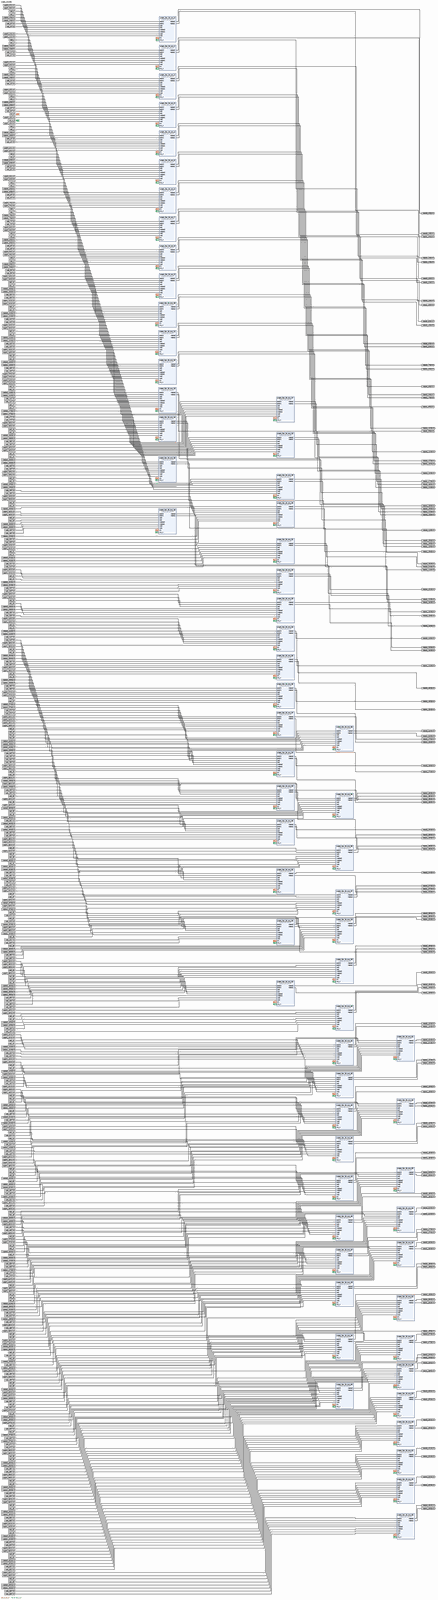
[diagram p0: block diagram of the top level, whole]
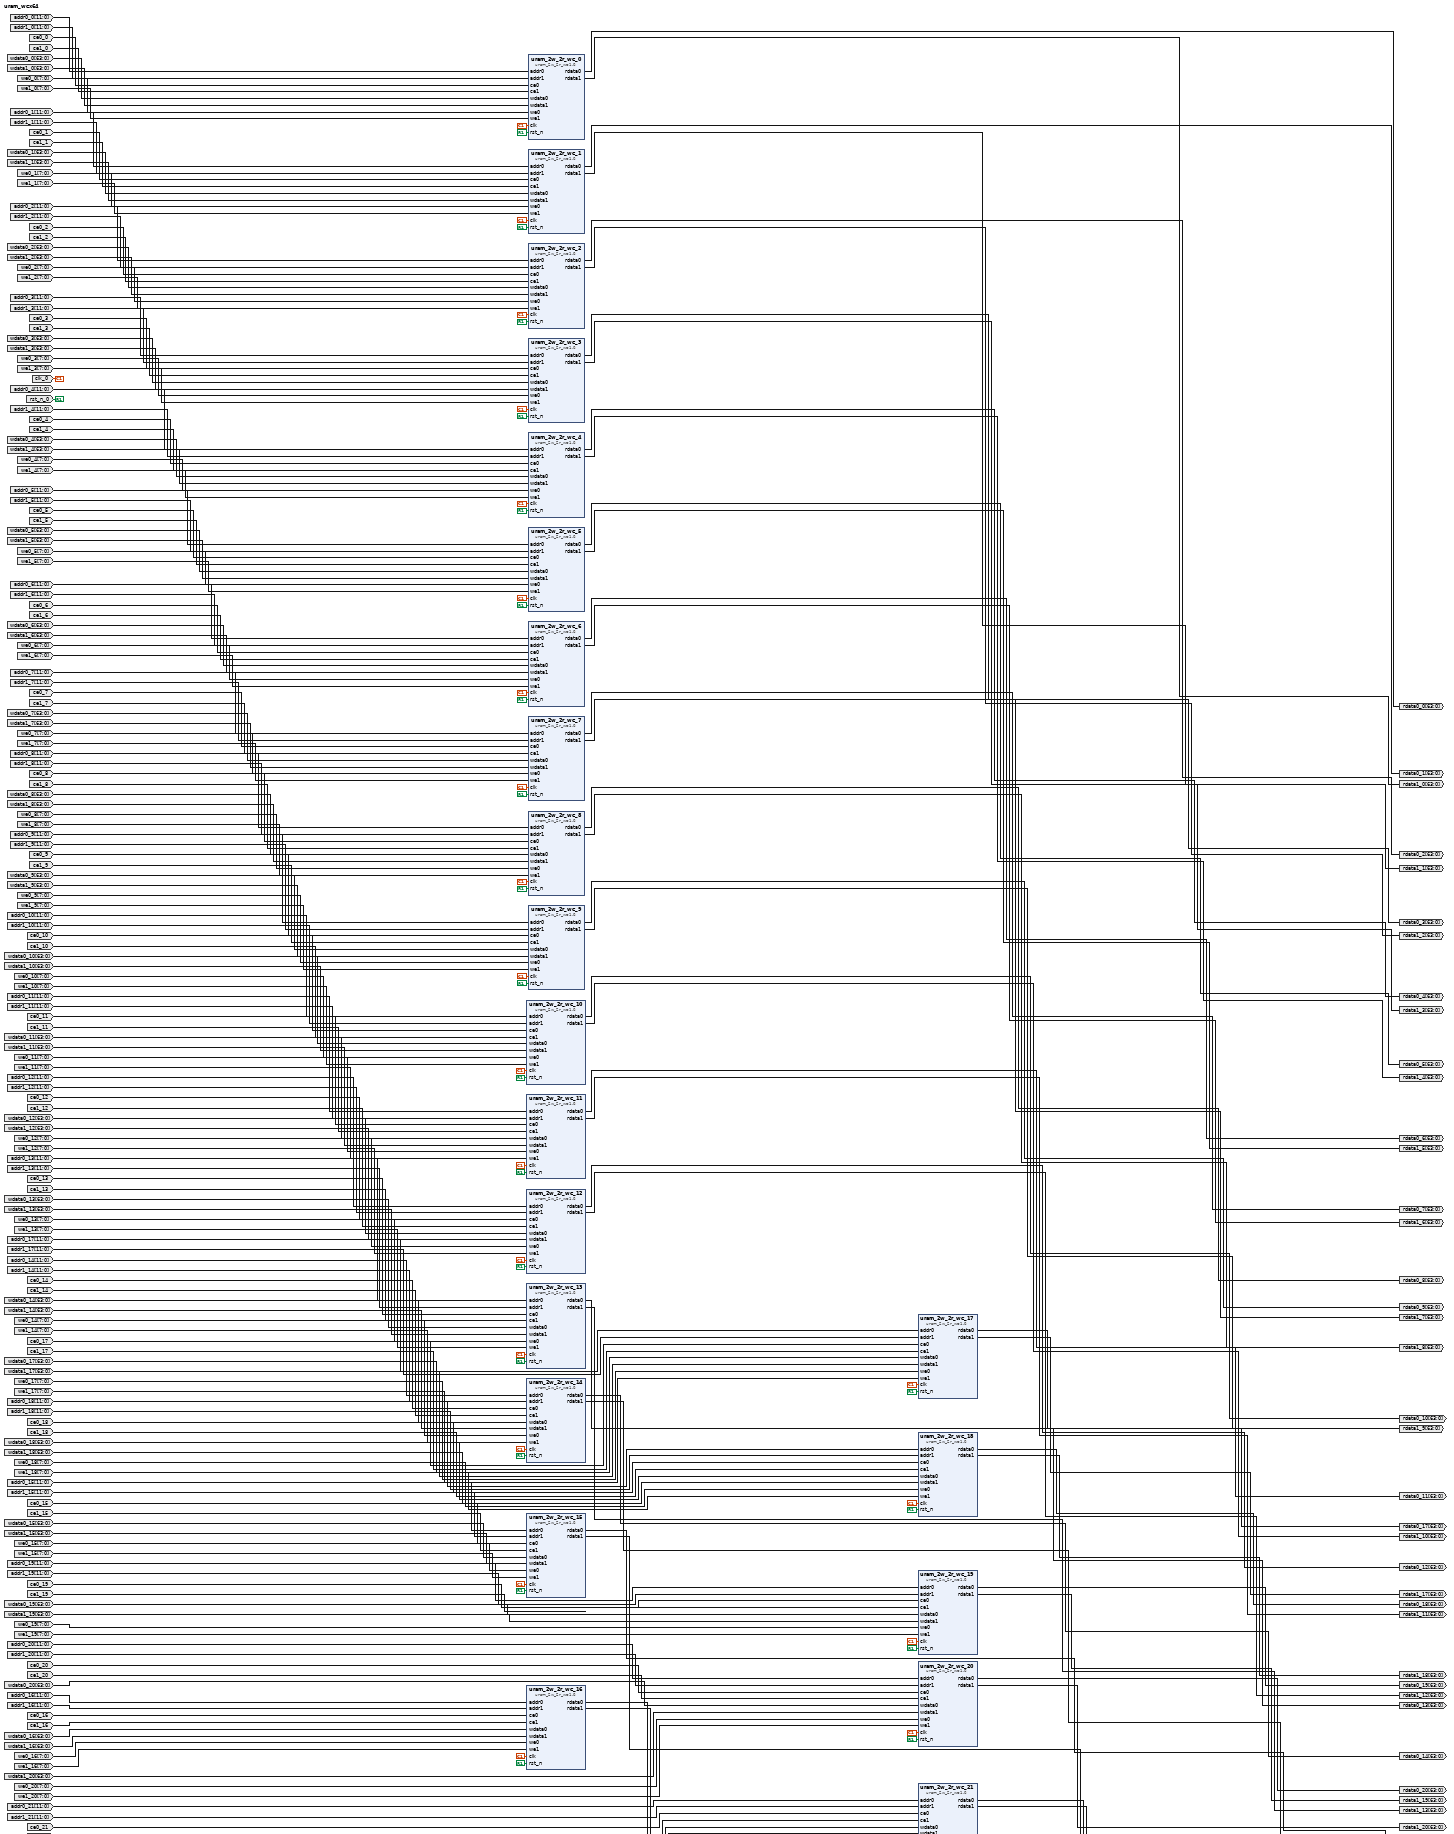
[diagram p1: block diagram of the top level, upper part]
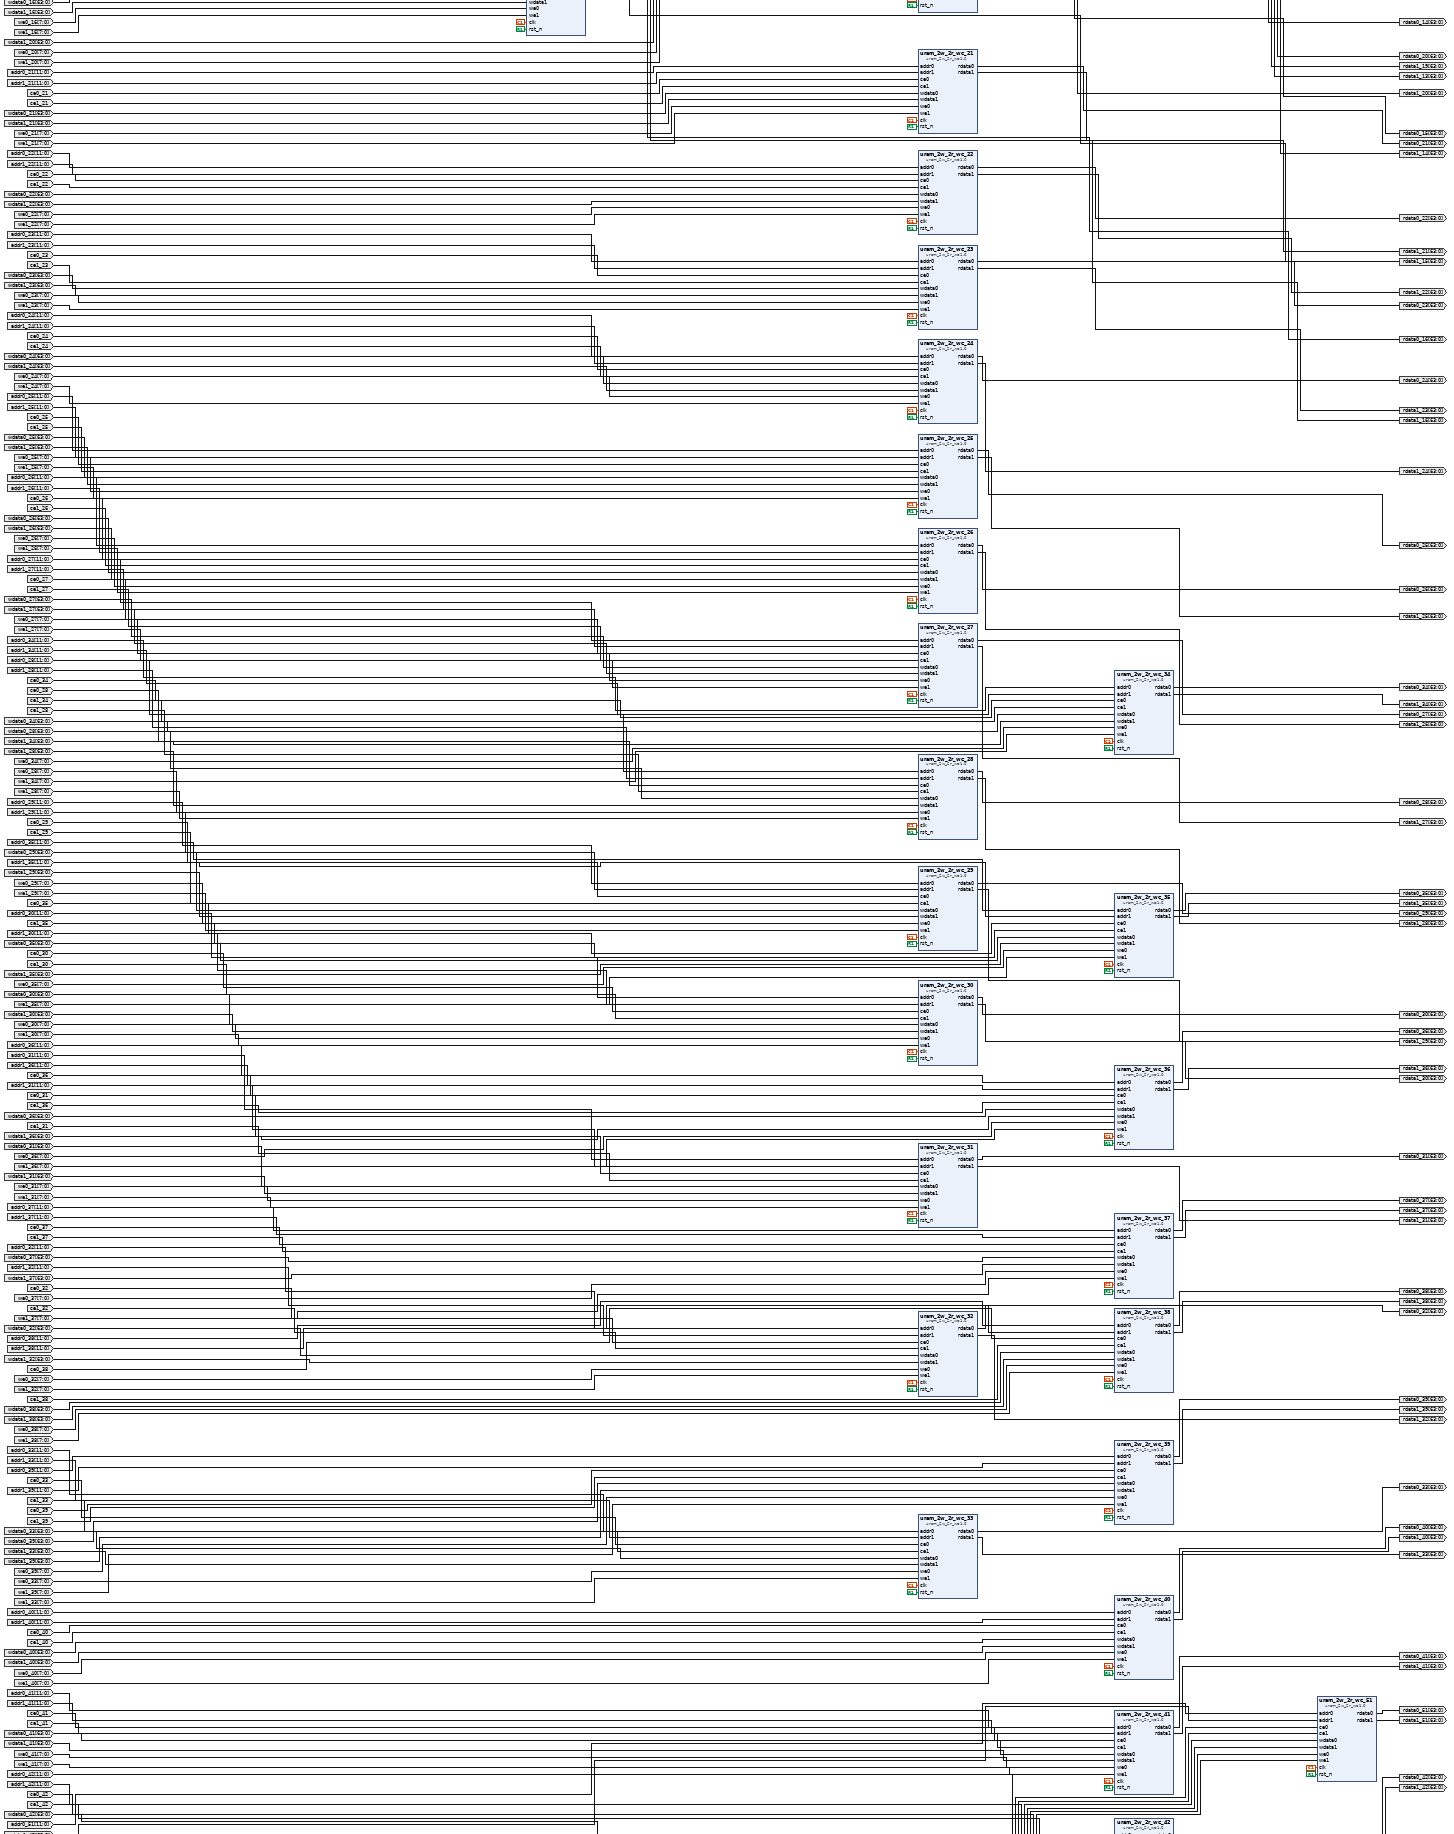
[diagram p2: block diagram of the top level, middle part]
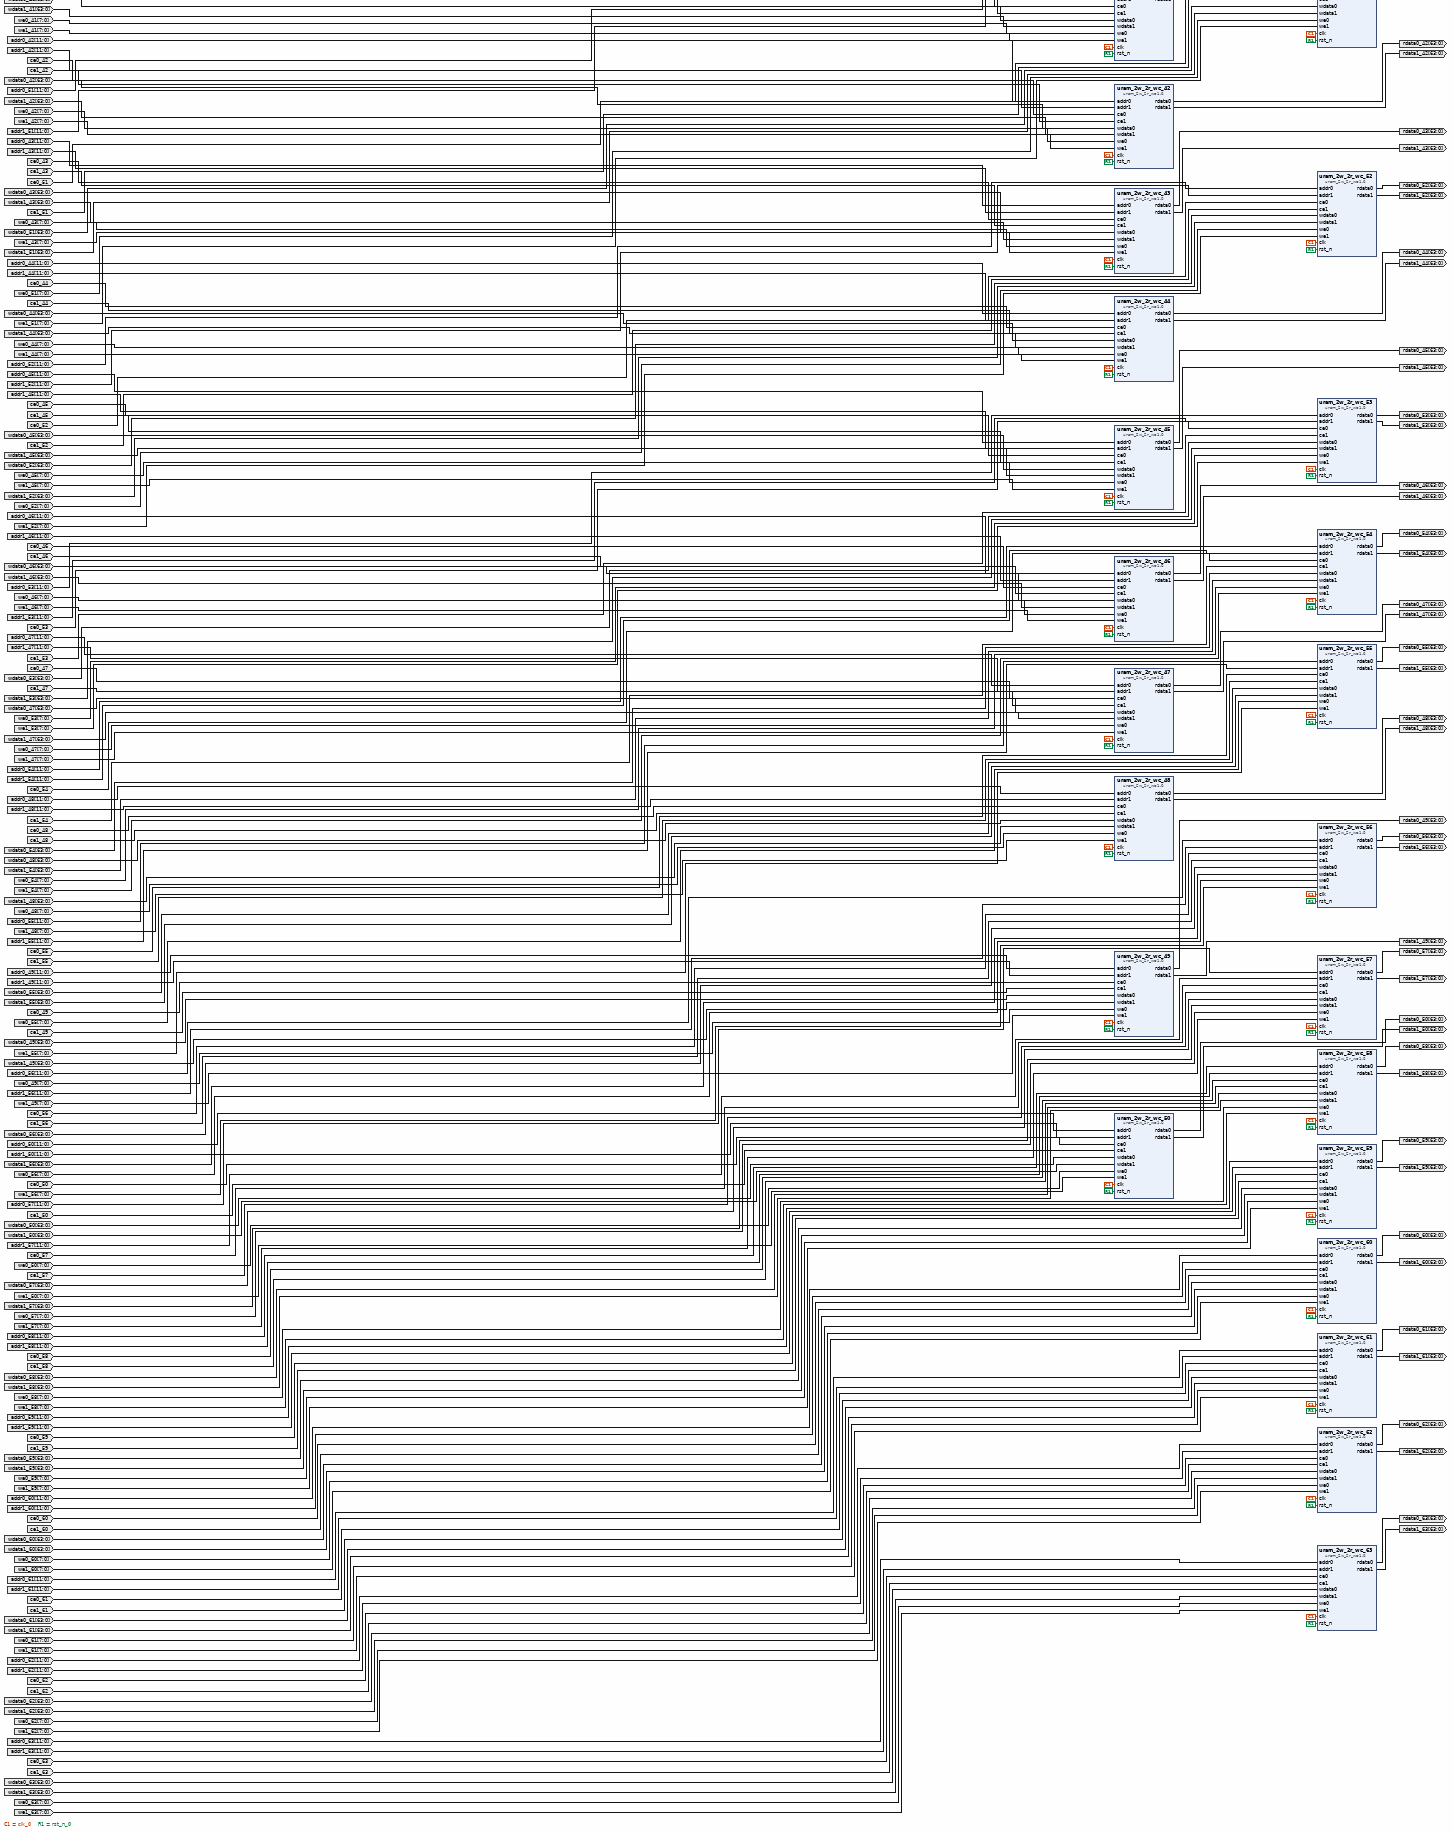
[diagram p3: block diagram of the top level, lower part]
# Vivado block design uram_wex64, xcu280-fsvh2892-2L-e, Vivado 2020.2
create_bd_design uram_wex64

create_bd_port -dir I -type clk clk_0
create_bd_port -dir I -type rst rst_n_0
create_bd_port -dir I -from 11 -to 0 addr0_0
create_bd_port -dir I -from 11 -to 0 addr1_0
create_bd_port -dir I ce0_0
create_bd_port -dir I ce1_0
create_bd_port -dir O -from 63 -to 0 rdata0_0
create_bd_port -dir O -from 63 -to 0 rdata1_0
create_bd_port -dir I -from 63 -to 0 wdata0_0
create_bd_port -dir I -from 63 -to 0 wdata1_0
create_bd_port -dir I -from 7 -to 0 we0_0
create_bd_port -dir I -from 7 -to 0 we1_0
create_bd_port -dir I -from 11 -to 0 addr0_1
create_bd_port -dir I -from 11 -to 0 addr1_1
create_bd_port -dir I ce0_1
create_bd_port -dir I ce1_1
create_bd_port -dir O -from 63 -to 0 rdata0_1
create_bd_port -dir O -from 63 -to 0 rdata1_1
create_bd_port -dir I -from 63 -to 0 wdata0_1
create_bd_port -dir I -from 63 -to 0 wdata1_1
create_bd_port -dir I -from 7 -to 0 we0_1
create_bd_port -dir I -from 7 -to 0 we1_1
create_bd_port -dir I -from 11 -to 0 addr0_2
create_bd_port -dir I -from 11 -to 0 addr1_2
create_bd_port -dir I ce0_2
create_bd_port -dir I ce1_2
create_bd_port -dir O -from 63 -to 0 rdata0_2
create_bd_port -dir O -from 63 -to 0 rdata1_2
create_bd_port -dir I -from 63 -to 0 wdata0_2
create_bd_port -dir I -from 63 -to 0 wdata1_2
create_bd_port -dir I -from 7 -to 0 we0_2
create_bd_port -dir I -from 7 -to 0 we1_2
create_bd_port -dir I -from 11 -to 0 addr0_3
create_bd_port -dir I -from 11 -to 0 addr1_3
create_bd_port -dir I ce0_3
create_bd_port -dir I ce1_3
create_bd_port -dir O -from 63 -to 0 rdata0_3
create_bd_port -dir O -from 63 -to 0 rdata1_3
create_bd_port -dir I -from 63 -to 0 wdata0_3
create_bd_port -dir I -from 63 -to 0 wdata1_3
create_bd_port -dir I -from 7 -to 0 we0_3
create_bd_port -dir I -from 7 -to 0 we1_3
create_bd_port -dir I -from 11 -to 0 addr0_4
create_bd_port -dir I -from 11 -to 0 addr1_4
create_bd_port -dir I ce0_4
create_bd_port -dir I ce1_4
create_bd_port -dir O -from 63 -to 0 rdata0_4
create_bd_port -dir O -from 63 -to 0 rdata1_4
create_bd_port -dir I -from 63 -to 0 wdata0_4
create_bd_port -dir I -from 63 -to 0 wdata1_4
create_bd_port -dir I -from 7 -to 0 we0_4
create_bd_port -dir I -from 7 -to 0 we1_4
create_bd_port -dir I -from 11 -to 0 addr0_5
create_bd_port -dir I -from 11 -to 0 addr1_5
create_bd_port -dir I ce0_5
create_bd_port -dir I ce1_5
create_bd_port -dir O -from 63 -to 0 rdata0_5
create_bd_port -dir O -from 63 -to 0 rdata1_5
create_bd_port -dir I -from 63 -to 0 wdata0_5
create_bd_port -dir I -from 63 -to 0 wdata1_5
create_bd_port -dir I -from 7 -to 0 we0_5
create_bd_port -dir I -from 7 -to 0 we1_5
create_bd_port -dir I -from 11 -to 0 addr0_6
create_bd_port -dir I -from 11 -to 0 addr1_6
create_bd_port -dir I ce0_6
create_bd_port -dir I ce1_6
create_bd_port -dir O -from 63 -to 0 rdata0_6
create_bd_port -dir O -from 63 -to 0 rdata1_6
create_bd_port -dir I -from 63 -to 0 wdata0_6
create_bd_port -dir I -from 63 -to 0 wdata1_6
create_bd_port -dir I -from 7 -to 0 we0_6
create_bd_port -dir I -from 7 -to 0 we1_6
create_bd_port -dir I -from 11 -to 0 addr0_7
create_bd_port -dir I -from 11 -to 0 addr1_7
create_bd_port -dir I ce0_7
create_bd_port -dir I ce1_7
create_bd_port -dir O -from 63 -to 0 rdata0_7
create_bd_port -dir O -from 63 -to 0 rdata1_7
create_bd_port -dir I -from 63 -to 0 wdata0_7
create_bd_port -dir I -from 63 -to 0 wdata1_7
create_bd_port -dir I -from 7 -to 0 we0_7
create_bd_port -dir I -from 7 -to 0 we1_7
create_bd_port -dir I -from 11 -to 0 addr0_8
create_bd_port -dir I -from 11 -to 0 addr1_8
create_bd_port -dir I ce0_8
create_bd_port -dir I ce1_8
create_bd_port -dir O -from 63 -to 0 rdata0_8
create_bd_port -dir O -from 63 -to 0 rdata1_8
create_bd_port -dir I -from 63 -to 0 wdata0_8
create_bd_port -dir I -from 63 -to 0 wdata1_8
create_bd_port -dir I -from 7 -to 0 we0_8
create_bd_port -dir I -from 7 -to 0 we1_8
create_bd_port -dir I -from 11 -to 0 addr0_9
create_bd_port -dir I -from 11 -to 0 addr1_9
create_bd_port -dir I ce0_9
create_bd_port -dir I ce1_9
create_bd_port -dir O -from 63 -to 0 rdata0_9
create_bd_port -dir O -from 63 -to 0 rdata1_9
create_bd_port -dir I -from 63 -to 0 wdata0_9
create_bd_port -dir I -from 63 -to 0 wdata1_9
create_bd_port -dir I -from 7 -to 0 we0_9
create_bd_port -dir I -from 7 -to 0 we1_9
create_bd_port -dir I -from 11 -to 0 addr0_10
create_bd_port -dir I -from 11 -to 0 addr1_10
create_bd_port -dir I ce0_10
create_bd_port -dir I ce1_10
create_bd_port -dir O -from 63 -to 0 rdata0_10
create_bd_port -dir O -from 63 -to 0 rdata1_10
create_bd_port -dir I -from 63 -to 0 wdata0_10
create_bd_port -dir I -from 63 -to 0 wdata1_10
create_bd_port -dir I -from 7 -to 0 we0_10
create_bd_port -dir I -from 7 -to 0 we1_10
create_bd_port -dir I -from 11 -to 0 addr0_11
create_bd_port -dir I -from 11 -to 0 addr1_11
create_bd_port -dir I ce0_11
create_bd_port -dir I ce1_11
create_bd_port -dir O -from 63 -to 0 rdata0_11
create_bd_port -dir O -from 63 -to 0 rdata1_11
create_bd_port -dir I -from 63 -to 0 wdata0_11
create_bd_port -dir I -from 63 -to 0 wdata1_11
create_bd_port -dir I -from 7 -to 0 we0_11
create_bd_port -dir I -from 7 -to 0 we1_11
create_bd_port -dir I -from 11 -to 0 addr0_12
create_bd_port -dir I -from 11 -to 0 addr1_12
create_bd_port -dir I ce0_12
create_bd_port -dir I ce1_12
create_bd_port -dir O -from 63 -to 0 rdata0_12
create_bd_port -dir O -from 63 -to 0 rdata1_12
create_bd_port -dir I -from 63 -to 0 wdata0_12
create_bd_port -dir I -from 63 -to 0 wdata1_12
create_bd_port -dir I -from 7 -to 0 we0_12
create_bd_port -dir I -from 7 -to 0 we1_12
create_bd_port -dir I -from 11 -to 0 addr0_13
create_bd_port -dir I -from 11 -to 0 addr1_13
create_bd_port -dir I ce0_13
create_bd_port -dir I ce1_13
create_bd_port -dir O -from 63 -to 0 rdata0_13
create_bd_port -dir O -from 63 -to 0 rdata1_13
create_bd_port -dir I -from 63 -to 0 wdata0_13
create_bd_port -dir I -from 63 -to 0 wdata1_13
create_bd_port -dir I -from 7 -to 0 we0_13
create_bd_port -dir I -from 7 -to 0 we1_13
create_bd_port -dir I -from 11 -to 0 addr0_14
create_bd_port -dir I -from 11 -to 0 addr1_14
create_bd_port -dir I ce0_14
create_bd_port -dir I ce1_14
create_bd_port -dir O -from 63 -to 0 rdata0_14
create_bd_port -dir O -from 63 -to 0 rdata1_14
create_bd_port -dir I -from 63 -to 0 wdata0_14
create_bd_port -dir I -from 63 -to 0 wdata1_14
create_bd_port -dir I -from 7 -to 0 we0_14
create_bd_port -dir I -from 7 -to 0 we1_14
create_bd_port -dir I -from 11 -to 0 addr0_15
create_bd_port -dir I -from 11 -to 0 addr1_15
create_bd_port -dir I ce0_15
create_bd_port -dir I ce1_15
create_bd_port -dir O -from 63 -to 0 rdata0_15
create_bd_port -dir O -from 63 -to 0 rdata1_15
create_bd_port -dir I -from 63 -to 0 wdata0_15
create_bd_port -dir I -from 63 -to 0 wdata1_15
create_bd_port -dir I -from 7 -to 0 we0_15
create_bd_port -dir I -from 7 -to 0 we1_15
create_bd_port -dir I -from 11 -to 0 addr0_16
create_bd_port -dir I -from 11 -to 0 addr1_16
create_bd_port -dir I ce0_16
create_bd_port -dir I ce1_16
create_bd_port -dir O -from 63 -to 0 rdata0_16
create_bd_port -dir O -from 63 -to 0 rdata1_16
create_bd_port -dir I -from 63 -to 0 wdata0_16
create_bd_port -dir I -from 63 -to 0 wdata1_16
create_bd_port -dir I -from 7 -to 0 we0_16
create_bd_port -dir I -from 7 -to 0 we1_16
create_bd_port -dir I -from 11 -to 0 addr0_17
create_bd_port -dir I -from 11 -to 0 addr1_17
create_bd_port -dir I ce0_17
create_bd_port -dir I ce1_17
create_bd_port -dir O -from 63 -to 0 rdata0_17
create_bd_port -dir O -from 63 -to 0 rdata1_17
create_bd_port -dir I -from 63 -to 0 wdata0_17
create_bd_port -dir I -from 63 -to 0 wdata1_17
create_bd_port -dir I -from 7 -to 0 we0_17
create_bd_port -dir I -from 7 -to 0 we1_17
create_bd_port -dir I -from 11 -to 0 addr0_18
create_bd_port -dir I -from 11 -to 0 addr1_18
create_bd_port -dir I ce0_18
create_bd_port -dir I ce1_18
create_bd_port -dir O -from 63 -to 0 rdata0_18
create_bd_port -dir O -from 63 -to 0 rdata1_18
create_bd_port -dir I -from 63 -to 0 wdata0_18
create_bd_port -dir I -from 63 -to 0 wdata1_18
create_bd_port -dir I -from 7 -to 0 we0_18
create_bd_port -dir I -from 7 -to 0 we1_18
create_bd_port -dir I -from 11 -to 0 addr0_19
create_bd_port -dir I -from 11 -to 0 addr1_19
create_bd_port -dir I ce0_19
create_bd_port -dir I ce1_19
create_bd_port -dir O -from 63 -to 0 rdata0_19
create_bd_port -dir O -from 63 -to 0 rdata1_19
create_bd_port -dir I -from 63 -to 0 wdata0_19
create_bd_port -dir I -from 63 -to 0 wdata1_19
create_bd_port -dir I -from 7 -to 0 we0_19
create_bd_port -dir I -from 7 -to 0 we1_19
create_bd_port -dir I -from 11 -to 0 addr0_20
create_bd_port -dir I -from 11 -to 0 addr1_20
create_bd_port -dir I ce0_20
create_bd_port -dir I ce1_20
create_bd_port -dir O -from 63 -to 0 rdata0_20
create_bd_port -dir O -from 63 -to 0 rdata1_20
create_bd_port -dir I -from 63 -to 0 wdata0_20
create_bd_port -dir I -from 63 -to 0 wdata1_20
create_bd_port -dir I -from 7 -to 0 we0_20
create_bd_port -dir I -from 7 -to 0 we1_20
create_bd_port -dir I -from 11 -to 0 addr0_21
create_bd_port -dir I -from 11 -to 0 addr1_21
create_bd_port -dir I ce0_21
create_bd_port -dir I ce1_21
create_bd_port -dir O -from 63 -to 0 rdata0_21
create_bd_port -dir O -from 63 -to 0 rdata1_21
create_bd_port -dir I -from 63 -to 0 wdata0_21
create_bd_port -dir I -from 63 -to 0 wdata1_21
create_bd_port -dir I -from 7 -to 0 we0_21
create_bd_port -dir I -from 7 -to 0 we1_21
create_bd_port -dir I -from 11 -to 0 addr0_22
create_bd_port -dir I -from 11 -to 0 addr1_22
create_bd_port -dir I ce0_22
create_bd_port -dir I ce1_22
create_bd_port -dir O -from 63 -to 0 rdata0_22
create_bd_port -dir O -from 63 -to 0 rdata1_22
create_bd_port -dir I -from 63 -to 0 wdata0_22
create_bd_port -dir I -from 63 -to 0 wdata1_22
create_bd_port -dir I -from 7 -to 0 we0_22
create_bd_port -dir I -from 7 -to 0 we1_22
create_bd_port -dir I -from 11 -to 0 addr0_23
create_bd_port -dir I -from 11 -to 0 addr1_23
create_bd_port -dir I ce0_23
create_bd_port -dir I ce1_23
create_bd_port -dir O -from 63 -to 0 rdata0_23
create_bd_port -dir O -from 63 -to 0 rdata1_23
create_bd_port -dir I -from 63 -to 0 wdata0_23
create_bd_port -dir I -from 63 -to 0 wdata1_23
create_bd_port -dir I -from 7 -to 0 we0_23
create_bd_port -dir I -from 7 -to 0 we1_23
create_bd_port -dir I -from 11 -to 0 addr0_24
create_bd_port -dir I -from 11 -to 0 addr1_24
create_bd_port -dir I ce0_24
create_bd_port -dir I ce1_24
create_bd_port -dir O -from 63 -to 0 rdata0_24
create_bd_port -dir O -from 63 -to 0 rdata1_24
create_bd_port -dir I -from 63 -to 0 wdata0_24
create_bd_port -dir I -from 63 -to 0 wdata1_24
create_bd_port -dir I -from 7 -to 0 we0_24
create_bd_port -dir I -from 7 -to 0 we1_24
create_bd_port -dir I -from 11 -to 0 addr0_25
create_bd_port -dir I -from 11 -to 0 addr1_25
create_bd_port -dir I ce0_25
create_bd_port -dir I ce1_25
create_bd_port -dir O -from 63 -to 0 rdata0_25
create_bd_port -dir O -from 63 -to 0 rdata1_25
create_bd_port -dir I -from 63 -to 0 wdata0_25
create_bd_port -dir I -from 63 -to 0 wdata1_25
create_bd_port -dir I -from 7 -to 0 we0_25
create_bd_port -dir I -from 7 -to 0 we1_25
create_bd_port -dir I -from 11 -to 0 addr0_26
create_bd_port -dir I -from 11 -to 0 addr1_26
create_bd_port -dir I ce0_26
create_bd_port -dir I ce1_26
create_bd_port -dir O -from 63 -to 0 rdata0_26
create_bd_port -dir O -from 63 -to 0 rdata1_26
create_bd_port -dir I -from 63 -to 0 wdata0_26
create_bd_port -dir I -from 63 -to 0 wdata1_26
create_bd_port -dir I -from 7 -to 0 we0_26
create_bd_port -dir I -from 7 -to 0 we1_26
create_bd_port -dir I -from 11 -to 0 addr0_27
create_bd_port -dir I -from 11 -to 0 addr1_27
create_bd_port -dir I ce0_27
create_bd_port -dir I ce1_27
create_bd_port -dir O -from 63 -to 0 rdata0_27
create_bd_port -dir O -from 63 -to 0 rdata1_27
create_bd_port -dir I -from 63 -to 0 wdata0_27
create_bd_port -dir I -from 63 -to 0 wdata1_27
create_bd_port -dir I -from 7 -to 0 we0_27
create_bd_port -dir I -from 7 -to 0 we1_27
create_bd_port -dir I -from 11 -to 0 addr0_28
create_bd_port -dir I -from 11 -to 0 addr1_28
create_bd_port -dir I ce0_28
create_bd_port -dir I ce1_28
create_bd_port -dir O -from 63 -to 0 rdata0_28
create_bd_port -dir O -from 63 -to 0 rdata1_28
create_bd_port -dir I -from 63 -to 0 wdata0_28
create_bd_port -dir I -from 63 -to 0 wdata1_28
create_bd_port -dir I -from 7 -to 0 we0_28
create_bd_port -dir I -from 7 -to 0 we1_28
create_bd_port -dir I -from 11 -to 0 addr0_29
create_bd_port -dir I -from 11 -to 0 addr1_29
create_bd_port -dir I ce0_29
create_bd_port -dir I ce1_29
create_bd_port -dir O -from 63 -to 0 rdata0_29
create_bd_port -dir O -from 63 -to 0 rdata1_29
create_bd_port -dir I -from 63 -to 0 wdata0_29
create_bd_port -dir I -from 63 -to 0 wdata1_29
create_bd_port -dir I -from 7 -to 0 we0_29
create_bd_port -dir I -from 7 -to 0 we1_29
create_bd_port -dir I -from 11 -to 0 addr0_30
create_bd_port -dir I -from 11 -to 0 addr1_30
create_bd_port -dir I ce0_30
create_bd_port -dir I ce1_30
create_bd_port -dir O -from 63 -to 0 rdata0_30
create_bd_port -dir O -from 63 -to 0 rdata1_30
create_bd_port -dir I -from 63 -to 0 wdata0_30
create_bd_port -dir I -from 63 -to 0 wdata1_30
create_bd_port -dir I -from 7 -to 0 we0_30
create_bd_port -dir I -from 7 -to 0 we1_30
create_bd_port -dir I -from 11 -to 0 addr0_31
create_bd_port -dir I -from 11 -to 0 addr1_31
create_bd_port -dir I ce0_31
create_bd_port -dir I ce1_31
create_bd_port -dir O -from 63 -to 0 rdata0_31
create_bd_port -dir O -from 63 -to 0 rdata1_31
create_bd_port -dir I -from 63 -to 0 wdata0_31
create_bd_port -dir I -from 63 -to 0 wdata1_31
create_bd_port -dir I -from 7 -to 0 we0_31
create_bd_port -dir I -from 7 -to 0 we1_31
create_bd_port -dir I -from 11 -to 0 addr0_32
create_bd_port -dir I -from 11 -to 0 addr1_32
create_bd_port -dir I ce0_32
create_bd_port -dir I ce1_32
create_bd_port -dir O -from 63 -to 0 rdata0_32
create_bd_port -dir O -from 63 -to 0 rdata1_32
create_bd_port -dir I -from 63 -to 0 wdata0_32
create_bd_port -dir I -from 63 -to 0 wdata1_32
create_bd_port -dir I -from 7 -to 0 we0_32
create_bd_port -dir I -from 7 -to 0 we1_32
create_bd_port -dir I -from 11 -to 0 addr0_33
create_bd_port -dir I -from 11 -to 0 addr1_33
create_bd_port -dir I ce0_33
create_bd_port -dir I ce1_33
create_bd_port -dir O -from 63 -to 0 rdata0_33
create_bd_port -dir O -from 63 -to 0 rdata1_33
create_bd_port -dir I -from 63 -to 0 wdata0_33
create_bd_port -dir I -from 63 -to 0 wdata1_33
create_bd_port -dir I -from 7 -to 0 we0_33
create_bd_port -dir I -from 7 -to 0 we1_33
create_bd_port -dir I -from 11 -to 0 addr0_34
create_bd_port -dir I -from 11 -to 0 addr1_34
create_bd_port -dir I ce0_34
create_bd_port -dir I ce1_34
create_bd_port -dir O -from 63 -to 0 rdata0_34
create_bd_port -dir O -from 63 -to 0 rdata1_34
create_bd_port -dir I -from 63 -to 0 wdata0_34
create_bd_port -dir I -from 63 -to 0 wdata1_34
create_bd_port -dir I -from 7 -to 0 we0_34
create_bd_port -dir I -from 7 -to 0 we1_34
create_bd_port -dir I -from 11 -to 0 addr0_35
create_bd_port -dir I -from 11 -to 0 addr1_35
create_bd_port -dir I ce0_35
create_bd_port -dir I ce1_35
create_bd_port -dir O -from 63 -to 0 rdata0_35
create_bd_port -dir O -from 63 -to 0 rdata1_35
create_bd_port -dir I -from 63 -to 0 wdata0_35
create_bd_port -dir I -from 63 -to 0 wdata1_35
create_bd_port -dir I -from 7 -to 0 we0_35
create_bd_port -dir I -from 7 -to 0 we1_35
create_bd_port -dir I -from 11 -to 0 addr0_36
create_bd_port -dir I -from 11 -to 0 addr1_36
create_bd_port -dir I ce0_36
create_bd_port -dir I ce1_36
create_bd_port -dir O -from 63 -to 0 rdata0_36
create_bd_port -dir O -from 63 -to 0 rdata1_36
create_bd_port -dir I -from 63 -to 0 wdata0_36
create_bd_port -dir I -from 63 -to 0 wdata1_36
create_bd_port -dir I -from 7 -to 0 we0_36
create_bd_port -dir I -from 7 -to 0 we1_36
create_bd_port -dir I -from 11 -to 0 addr0_37
create_bd_port -dir I -from 11 -to 0 addr1_37
create_bd_port -dir I ce0_37
create_bd_port -dir I ce1_37
create_bd_port -dir O -from 63 -to 0 rdata0_37
create_bd_port -dir O -from 63 -to 0 rdata1_37
create_bd_port -dir I -from 63 -to 0 wdata0_37
create_bd_port -dir I -from 63 -to 0 wdata1_37
create_bd_port -dir I -from 7 -to 0 we0_37
create_bd_port -dir I -from 7 -to 0 we1_37
create_bd_port -dir I -from 11 -to 0 addr0_38
create_bd_port -dir I -from 11 -to 0 addr1_38
create_bd_port -dir I ce0_38
create_bd_port -dir I ce1_38
create_bd_port -dir O -from 63 -to 0 rdata0_38
create_bd_port -dir O -from 63 -to 0 rdata1_38
create_bd_port -dir I -from 63 -to 0 wdata0_38
create_bd_port -dir I -from 63 -to 0 wdata1_38
create_bd_port -dir I -from 7 -to 0 we0_38
create_bd_port -dir I -from 7 -to 0 we1_38
create_bd_port -dir I -from 11 -to 0 addr0_39
create_bd_port -dir I -from 11 -to 0 addr1_39
create_bd_port -dir I ce0_39
create_bd_port -dir I ce1_39
create_bd_port -dir O -from 63 -to 0 rdata0_39
create_bd_port -dir O -from 63 -to 0 rdata1_39
create_bd_port -dir I -from 63 -to 0 wdata0_39
create_bd_port -dir I -from 63 -to 0 wdata1_39
create_bd_port -dir I -from 7 -to 0 we0_39
create_bd_port -dir I -from 7 -to 0 we1_39
create_bd_port -dir I -from 11 -to 0 addr0_40
create_bd_port -dir I -from 11 -to 0 addr1_40
create_bd_port -dir I ce0_40
create_bd_port -dir I ce1_40
create_bd_port -dir O -from 63 -to 0 rdata0_40
create_bd_port -dir O -from 63 -to 0 rdata1_40
create_bd_port -dir I -from 63 -to 0 wdata0_40
create_bd_port -dir I -from 63 -to 0 wdata1_40
create_bd_port -dir I -from 7 -to 0 we0_40
create_bd_port -dir I -from 7 -to 0 we1_40
create_bd_port -dir I -from 11 -to 0 addr0_41
create_bd_port -dir I -from 11 -to 0 addr1_41
create_bd_port -dir I ce0_41
create_bd_port -dir I ce1_41
create_bd_port -dir O -from 63 -to 0 rdata0_41
create_bd_port -dir O -from 63 -to 0 rdata1_41
create_bd_port -dir I -from 63 -to 0 wdata0_41
create_bd_port -dir I -from 63 -to 0 wdata1_41
create_bd_port -dir I -from 7 -to 0 we0_41
create_bd_port -dir I -from 7 -to 0 we1_41
create_bd_port -dir I -from 11 -to 0 addr0_42
create_bd_port -dir I -from 11 -to 0 addr1_42
create_bd_port -dir I ce0_42
create_bd_port -dir I ce1_42
create_bd_port -dir O -from 63 -to 0 rdata0_42
create_bd_port -dir O -from 63 -to 0 rdata1_42
create_bd_port -dir I -from 63 -to 0 wdata0_42
create_bd_port -dir I -from 63 -to 0 wdata1_42
create_bd_port -dir I -from 7 -to 0 we0_42
create_bd_port -dir I -from 7 -to 0 we1_42
create_bd_port -dir I -from 11 -to 0 addr0_43
create_bd_port -dir I -from 11 -to 0 addr1_43
create_bd_port -dir I ce0_43
create_bd_port -dir I ce1_43
create_bd_port -dir O -from 63 -to 0 rdata0_43
create_bd_port -dir O -from 63 -to 0 rdata1_43
create_bd_port -dir I -from 63 -to 0 wdata0_43
create_bd_port -dir I -from 63 -to 0 wdata1_43
create_bd_port -dir I -from 7 -to 0 we0_43
create_bd_port -dir I -from 7 -to 0 we1_43
create_bd_port -dir I -from 11 -to 0 addr0_44
create_bd_port -dir I -from 11 -to 0 addr1_44
create_bd_port -dir I ce0_44
create_bd_port -dir I ce1_44
create_bd_port -dir O -from 63 -to 0 rdata0_44
create_bd_port -dir O -from 63 -to 0 rdata1_44
create_bd_port -dir I -from 63 -to 0 wdata0_44
create_bd_port -dir I -from 63 -to 0 wdata1_44
create_bd_port -dir I -from 7 -to 0 we0_44
create_bd_port -dir I -from 7 -to 0 we1_44
create_bd_port -dir I -from 11 -to 0 addr0_45
create_bd_port -dir I -from 11 -to 0 addr1_45
create_bd_port -dir I ce0_45
create_bd_port -dir I ce1_45
create_bd_port -dir O -from 63 -to 0 rdata0_45
create_bd_port -dir O -from 63 -to 0 rdata1_45
create_bd_port -dir I -from 63 -to 0 wdata0_45
create_bd_port -dir I -from 63 -to 0 wdata1_45
create_bd_port -dir I -from 7 -to 0 we0_45
create_bd_port -dir I -from 7 -to 0 we1_45
create_bd_port -dir I -from 11 -to 0 addr0_46
create_bd_port -dir I -from 11 -to 0 addr1_46
create_bd_port -dir I ce0_46
create_bd_port -dir I ce1_46
create_bd_port -dir O -from 63 -to 0 rdata0_46
create_bd_port -dir O -from 63 -to 0 rdata1_46
create_bd_port -dir I -from 63 -to 0 wdata0_46
create_bd_port -dir I -from 63 -to 0 wdata1_46
create_bd_port -dir I -from 7 -to 0 we0_46
create_bd_port -dir I -from 7 -to 0 we1_46
create_bd_port -dir I -from 11 -to 0 addr0_47
create_bd_port -dir I -from 11 -to 0 addr1_47
create_bd_port -dir I ce0_47
create_bd_port -dir I ce1_47
create_bd_port -dir O -from 63 -to 0 rdata0_47
create_bd_port -dir O -from 63 -to 0 rdata1_47
create_bd_port -dir I -from 63 -to 0 wdata0_47
create_bd_port -dir I -from 63 -to 0 wdata1_47
create_bd_port -dir I -from 7 -to 0 we0_47
create_bd_port -dir I -from 7 -to 0 we1_47
create_bd_port -dir I -from 11 -to 0 addr0_48
create_bd_port -dir I -from 11 -to 0 addr1_48
create_bd_port -dir I ce0_48
create_bd_port -dir I ce1_48
create_bd_port -dir O -from 63 -to 0 rdata0_48
create_bd_port -dir O -from 63 -to 0 rdata1_48
create_bd_port -dir I -from 63 -to 0 wdata0_48
create_bd_port -dir I -from 63 -to 0 wdata1_48
create_bd_port -dir I -from 7 -to 0 we0_48
create_bd_port -dir I -from 7 -to 0 we1_48
create_bd_port -dir I -from 11 -to 0 addr0_49
create_bd_port -dir I -from 11 -to 0 addr1_49
create_bd_port -dir I ce0_49
create_bd_port -dir I ce1_49
create_bd_port -dir O -from 63 -to 0 rdata0_49
create_bd_port -dir O -from 63 -to 0 rdata1_49
create_bd_port -dir I -from 63 -to 0 wdata0_49
create_bd_port -dir I -from 63 -to 0 wdata1_49
create_bd_port -dir I -from 7 -to 0 we0_49
create_bd_port -dir I -from 7 -to 0 we1_49
create_bd_port -dir I -from 11 -to 0 addr0_50
create_bd_port -dir I -from 11 -to 0 addr1_50
create_bd_port -dir I ce0_50
create_bd_port -dir I ce1_50
create_bd_port -dir O -from 63 -to 0 rdata0_50
create_bd_port -dir O -from 63 -to 0 rdata1_50
create_bd_port -dir I -from 63 -to 0 wdata0_50
create_bd_port -dir I -from 63 -to 0 wdata1_50
create_bd_port -dir I -from 7 -to 0 we0_50
create_bd_port -dir I -from 7 -to 0 we1_50
create_bd_port -dir I -from 11 -to 0 addr0_51
create_bd_port -dir I -from 11 -to 0 addr1_51
create_bd_port -dir I ce0_51
create_bd_port -dir I ce1_51
create_bd_port -dir O -from 63 -to 0 rdata0_51
create_bd_port -dir O -from 63 -to 0 rdata1_51
create_bd_port -dir I -from 63 -to 0 wdata0_51
create_bd_port -dir I -from 63 -to 0 wdata1_51
create_bd_port -dir I -from 7 -to 0 we0_51
create_bd_port -dir I -from 7 -to 0 we1_51
create_bd_port -dir I -from 11 -to 0 addr0_52
create_bd_port -dir I -from 11 -to 0 addr1_52
create_bd_port -dir I ce0_52
create_bd_port -dir I ce1_52
create_bd_port -dir O -from 63 -to 0 rdata0_52
create_bd_port -dir O -from 63 -to 0 rdata1_52
create_bd_port -dir I -from 63 -to 0 wdata0_52
create_bd_port -dir I -from 63 -to 0 wdata1_52
create_bd_port -dir I -from 7 -to 0 we0_52
create_bd_port -dir I -from 7 -to 0 we1_52
create_bd_port -dir I -from 11 -to 0 addr0_53
create_bd_port -dir I -from 11 -to 0 addr1_53
create_bd_port -dir I ce0_53
create_bd_port -dir I ce1_53
create_bd_port -dir O -from 63 -to 0 rdata0_53
create_bd_port -dir O -from 63 -to 0 rdata1_53
create_bd_port -dir I -from 63 -to 0 wdata0_53
create_bd_port -dir I -from 63 -to 0 wdata1_53
create_bd_port -dir I -from 7 -to 0 we0_53
create_bd_port -dir I -from 7 -to 0 we1_53
create_bd_port -dir I -from 11 -to 0 addr0_54
create_bd_port -dir I -from 11 -to 0 addr1_54
create_bd_port -dir I ce0_54
create_bd_port -dir I ce1_54
create_bd_port -dir O -from 63 -to 0 rdata0_54
create_bd_port -dir O -from 63 -to 0 rdata1_54
create_bd_port -dir I -from 63 -to 0 wdata0_54
create_bd_port -dir I -from 63 -to 0 wdata1_54
create_bd_port -dir I -from 7 -to 0 we0_54
create_bd_port -dir I -from 7 -to 0 we1_54
create_bd_port -dir I -from 11 -to 0 addr0_55
create_bd_port -dir I -from 11 -to 0 addr1_55
create_bd_port -dir I ce0_55
create_bd_port -dir I ce1_55
create_bd_port -dir O -from 63 -to 0 rdata0_55
create_bd_port -dir O -from 63 -to 0 rdata1_55
create_bd_port -dir I -from 63 -to 0 wdata0_55
create_bd_port -dir I -from 63 -to 0 wdata1_55
create_bd_port -dir I -from 7 -to 0 we0_55
create_bd_port -dir I -from 7 -to 0 we1_55
create_bd_port -dir I -from 11 -to 0 addr0_56
create_bd_port -dir I -from 11 -to 0 addr1_56
create_bd_port -dir I ce0_56
create_bd_port -dir I ce1_56
create_bd_port -dir O -from 63 -to 0 rdata0_56
create_bd_port -dir O -from 63 -to 0 rdata1_56
create_bd_port -dir I -from 63 -to 0 wdata0_56
create_bd_port -dir I -from 63 -to 0 wdata1_56
create_bd_port -dir I -from 7 -to 0 we0_56
create_bd_port -dir I -from 7 -to 0 we1_56
create_bd_port -dir I -from 11 -to 0 addr0_57
create_bd_port -dir I -from 11 -to 0 addr1_57
create_bd_port -dir I ce0_57
create_bd_port -dir I ce1_57
create_bd_port -dir O -from 63 -to 0 rdata0_57
create_bd_port -dir O -from 63 -to 0 rdata1_57
create_bd_port -dir I -from 63 -to 0 wdata0_57
create_bd_port -dir I -from 63 -to 0 wdata1_57
create_bd_port -dir I -from 7 -to 0 we0_57
create_bd_port -dir I -from 7 -to 0 we1_57
create_bd_port -dir I -from 11 -to 0 addr0_58
create_bd_port -dir I -from 11 -to 0 addr1_58
create_bd_port -dir I ce0_58
create_bd_port -dir I ce1_58
create_bd_port -dir O -from 63 -to 0 rdata0_58
create_bd_port -dir O -from 63 -to 0 rdata1_58
create_bd_port -dir I -from 63 -to 0 wdata0_58
create_bd_port -dir I -from 63 -to 0 wdata1_58
create_bd_port -dir I -from 7 -to 0 we0_58
create_bd_port -dir I -from 7 -to 0 we1_58
create_bd_port -dir I -from 11 -to 0 addr0_59
create_bd_port -dir I -from 11 -to 0 addr1_59
create_bd_port -dir I ce0_59
create_bd_port -dir I ce1_59
create_bd_port -dir O -from 63 -to 0 rdata0_59
create_bd_port -dir O -from 63 -to 0 rdata1_59
create_bd_port -dir I -from 63 -to 0 wdata0_59
create_bd_port -dir I -from 63 -to 0 wdata1_59
create_bd_port -dir I -from 7 -to 0 we0_59
create_bd_port -dir I -from 7 -to 0 we1_59
create_bd_port -dir I -from 11 -to 0 addr0_60
create_bd_port -dir I -from 11 -to 0 addr1_60
create_bd_port -dir I ce0_60
create_bd_port -dir I ce1_60
create_bd_port -dir O -from 63 -to 0 rdata0_60
create_bd_port -dir O -from 63 -to 0 rdata1_60
create_bd_port -dir I -from 63 -to 0 wdata0_60
create_bd_port -dir I -from 63 -to 0 wdata1_60
create_bd_port -dir I -from 7 -to 0 we0_60
create_bd_port -dir I -from 7 -to 0 we1_60
create_bd_port -dir I -from 11 -to 0 addr0_61
create_bd_port -dir I -from 11 -to 0 addr1_61
create_bd_port -dir I ce0_61
create_bd_port -dir I ce1_61
create_bd_port -dir O -from 63 -to 0 rdata0_61
create_bd_port -dir O -from 63 -to 0 rdata1_61
create_bd_port -dir I -from 63 -to 0 wdata0_61
create_bd_port -dir I -from 63 -to 0 wdata1_61
create_bd_port -dir I -from 7 -to 0 we0_61
create_bd_port -dir I -from 7 -to 0 we1_61
create_bd_port -dir I -from 11 -to 0 addr0_62
create_bd_port -dir I -from 11 -to 0 addr1_62
create_bd_port -dir I ce0_62
create_bd_port -dir I ce1_62
create_bd_port -dir O -from 63 -to 0 rdata0_62
create_bd_port -dir O -from 63 -to 0 rdata1_62
create_bd_port -dir I -from 63 -to 0 wdata0_62
create_bd_port -dir I -from 63 -to 0 wdata1_62
create_bd_port -dir I -from 7 -to 0 we0_62
create_bd_port -dir I -from 7 -to 0 we1_62
create_bd_port -dir I -from 11 -to 0 addr0_63
create_bd_port -dir I -from 11 -to 0 addr1_63
create_bd_port -dir I ce0_63
create_bd_port -dir I ce1_63
create_bd_port -dir O -from 63 -to 0 rdata0_63
create_bd_port -dir O -from 63 -to 0 rdata1_63
create_bd_port -dir I -from 63 -to 0 wdata0_63
create_bd_port -dir I -from 63 -to 0 wdata1_63
create_bd_port -dir I -from 7 -to 0 we0_63
create_bd_port -dir I -from 7 -to 0 we1_63

create_bd_cell -type ip -vlnv user.org:user:uram_2w_2r_we:1.0 uram_2w_2r_we_0
create_bd_cell -type ip -vlnv user.org:user:uram_2w_2r_we:1.0 uram_2w_2r_we_1
create_bd_cell -type ip -vlnv user.org:user:uram_2w_2r_we:1.0 uram_2w_2r_we_2
create_bd_cell -type ip -vlnv user.org:user:uram_2w_2r_we:1.0 uram_2w_2r_we_3
create_bd_cell -type ip -vlnv user.org:user:uram_2w_2r_we:1.0 uram_2w_2r_we_4
create_bd_cell -type ip -vlnv user.org:user:uram_2w_2r_we:1.0 uram_2w_2r_we_5
create_bd_cell -type ip -vlnv user.org:user:uram_2w_2r_we:1.0 uram_2w_2r_we_6
create_bd_cell -type ip -vlnv user.org:user:uram_2w_2r_we:1.0 uram_2w_2r_we_7
create_bd_cell -type ip -vlnv user.org:user:uram_2w_2r_we:1.0 uram_2w_2r_we_8
create_bd_cell -type ip -vlnv user.org:user:uram_2w_2r_we:1.0 uram_2w_2r_we_9
create_bd_cell -type ip -vlnv user.org:user:uram_2w_2r_we:1.0 uram_2w_2r_we_10
create_bd_cell -type ip -vlnv user.org:user:uram_2w_2r_we:1.0 uram_2w_2r_we_11
create_bd_cell -type ip -vlnv user.org:user:uram_2w_2r_we:1.0 uram_2w_2r_we_12
create_bd_cell -type ip -vlnv user.org:user:uram_2w_2r_we:1.0 uram_2w_2r_we_13
create_bd_cell -type ip -vlnv user.org:user:uram_2w_2r_we:1.0 uram_2w_2r_we_14
create_bd_cell -type ip -vlnv user.org:user:uram_2w_2r_we:1.0 uram_2w_2r_we_15
create_bd_cell -type ip -vlnv user.org:user:uram_2w_2r_we:1.0 uram_2w_2r_we_16
create_bd_cell -type ip -vlnv user.org:user:uram_2w_2r_we:1.0 uram_2w_2r_we_17
create_bd_cell -type ip -vlnv user.org:user:uram_2w_2r_we:1.0 uram_2w_2r_we_18
create_bd_cell -type ip -vlnv user.org:user:uram_2w_2r_we:1.0 uram_2w_2r_we_19
create_bd_cell -type ip -vlnv user.org:user:uram_2w_2r_we:1.0 uram_2w_2r_we_20
create_bd_cell -type ip -vlnv user.org:user:uram_2w_2r_we:1.0 uram_2w_2r_we_21
create_bd_cell -type ip -vlnv user.org:user:uram_2w_2r_we:1.0 uram_2w_2r_we_22
create_bd_cell -type ip -vlnv user.org:user:uram_2w_2r_we:1.0 uram_2w_2r_we_23
create_bd_cell -type ip -vlnv user.org:user:uram_2w_2r_we:1.0 uram_2w_2r_we_24
create_bd_cell -type ip -vlnv user.org:user:uram_2w_2r_we:1.0 uram_2w_2r_we_25
create_bd_cell -type ip -vlnv user.org:user:uram_2w_2r_we:1.0 uram_2w_2r_we_26
create_bd_cell -type ip -vlnv user.org:user:uram_2w_2r_we:1.0 uram_2w_2r_we_27
create_bd_cell -type ip -vlnv user.org:user:uram_2w_2r_we:1.0 uram_2w_2r_we_28
create_bd_cell -type ip -vlnv user.org:user:uram_2w_2r_we:1.0 uram_2w_2r_we_29
create_bd_cell -type ip -vlnv user.org:user:uram_2w_2r_we:1.0 uram_2w_2r_we_30
create_bd_cell -type ip -vlnv user.org:user:uram_2w_2r_we:1.0 uram_2w_2r_we_31
create_bd_cell -type ip -vlnv user.org:user:uram_2w_2r_we:1.0 uram_2w_2r_we_32
create_bd_cell -type ip -vlnv user.org:user:uram_2w_2r_we:1.0 uram_2w_2r_we_33
create_bd_cell -type ip -vlnv user.org:user:uram_2w_2r_we:1.0 uram_2w_2r_we_34
create_bd_cell -type ip -vlnv user.org:user:uram_2w_2r_we:1.0 uram_2w_2r_we_35
create_bd_cell -type ip -vlnv user.org:user:uram_2w_2r_we:1.0 uram_2w_2r_we_36
create_bd_cell -type ip -vlnv user.org:user:uram_2w_2r_we:1.0 uram_2w_2r_we_37
create_bd_cell -type ip -vlnv user.org:user:uram_2w_2r_we:1.0 uram_2w_2r_we_38
create_bd_cell -type ip -vlnv user.org:user:uram_2w_2r_we:1.0 uram_2w_2r_we_39
create_bd_cell -type ip -vlnv user.org:user:uram_2w_2r_we:1.0 uram_2w_2r_we_40
create_bd_cell -type ip -vlnv user.org:user:uram_2w_2r_we:1.0 uram_2w_2r_we_41
create_bd_cell -type ip -vlnv user.org:user:uram_2w_2r_we:1.0 uram_2w_2r_we_42
create_bd_cell -type ip -vlnv user.org:user:uram_2w_2r_we:1.0 uram_2w_2r_we_43
create_bd_cell -type ip -vlnv user.org:user:uram_2w_2r_we:1.0 uram_2w_2r_we_44
create_bd_cell -type ip -vlnv user.org:user:uram_2w_2r_we:1.0 uram_2w_2r_we_45
create_bd_cell -type ip -vlnv user.org:user:uram_2w_2r_we:1.0 uram_2w_2r_we_46
create_bd_cell -type ip -vlnv user.org:user:uram_2w_2r_we:1.0 uram_2w_2r_we_47
create_bd_cell -type ip -vlnv user.org:user:uram_2w_2r_we:1.0 uram_2w_2r_we_48
create_bd_cell -type ip -vlnv user.org:user:uram_2w_2r_we:1.0 uram_2w_2r_we_49
create_bd_cell -type ip -vlnv user.org:user:uram_2w_2r_we:1.0 uram_2w_2r_we_50
create_bd_cell -type ip -vlnv user.org:user:uram_2w_2r_we:1.0 uram_2w_2r_we_51
create_bd_cell -type ip -vlnv user.org:user:uram_2w_2r_we:1.0 uram_2w_2r_we_52
create_bd_cell -type ip -vlnv user.org:user:uram_2w_2r_we:1.0 uram_2w_2r_we_53
create_bd_cell -type ip -vlnv user.org:user:uram_2w_2r_we:1.0 uram_2w_2r_we_54
create_bd_cell -type ip -vlnv user.org:user:uram_2w_2r_we:1.0 uram_2w_2r_we_55
create_bd_cell -type ip -vlnv user.org:user:uram_2w_2r_we:1.0 uram_2w_2r_we_56
create_bd_cell -type ip -vlnv user.org:user:uram_2w_2r_we:1.0 uram_2w_2r_we_57
create_bd_cell -type ip -vlnv user.org:user:uram_2w_2r_we:1.0 uram_2w_2r_we_58
create_bd_cell -type ip -vlnv user.org:user:uram_2w_2r_we:1.0 uram_2w_2r_we_59
create_bd_cell -type ip -vlnv user.org:user:uram_2w_2r_we:1.0 uram_2w_2r_we_60
create_bd_cell -type ip -vlnv user.org:user:uram_2w_2r_we:1.0 uram_2w_2r_we_61
create_bd_cell -type ip -vlnv user.org:user:uram_2w_2r_we:1.0 uram_2w_2r_we_62
create_bd_cell -type ip -vlnv user.org:user:uram_2w_2r_we:1.0 uram_2w_2r_we_63

# ---- connections ----

connect_bd_net -net clk_0_1 [get_bd_ports clk_0] \
  [get_bd_pins uram_2w_2r_we_0/clk] [get_bd_pins uram_2w_2r_we_1/clk] [get_bd_pins uram_2w_2r_we_2/clk] \
  [get_bd_pins uram_2w_2r_we_3/clk] [get_bd_pins uram_2w_2r_we_4/clk] [get_bd_pins uram_2w_2r_we_5/clk] \
  [get_bd_pins uram_2w_2r_we_6/clk] [get_bd_pins uram_2w_2r_we_7/clk] [get_bd_pins uram_2w_2r_we_8/clk] \
  [get_bd_pins uram_2w_2r_we_9/clk] [get_bd_pins uram_2w_2r_we_10/clk] [get_bd_pins uram_2w_2r_we_11/clk] \
  [get_bd_pins uram_2w_2r_we_12/clk] [get_bd_pins uram_2w_2r_we_13/clk] [get_bd_pins uram_2w_2r_we_14/clk] \
  [get_bd_pins uram_2w_2r_we_15/clk] [get_bd_pins uram_2w_2r_we_16/clk] [get_bd_pins uram_2w_2r_we_17/clk] \
  [get_bd_pins uram_2w_2r_we_18/clk] [get_bd_pins uram_2w_2r_we_19/clk] [get_bd_pins uram_2w_2r_we_20/clk] \
  [get_bd_pins uram_2w_2r_we_21/clk] [get_bd_pins uram_2w_2r_we_22/clk] [get_bd_pins uram_2w_2r_we_23/clk] \
  [get_bd_pins uram_2w_2r_we_24/clk] [get_bd_pins uram_2w_2r_we_25/clk] [get_bd_pins uram_2w_2r_we_26/clk] \
  [get_bd_pins uram_2w_2r_we_27/clk] [get_bd_pins uram_2w_2r_we_28/clk] [get_bd_pins uram_2w_2r_we_29/clk] \
  [get_bd_pins uram_2w_2r_we_30/clk] [get_bd_pins uram_2w_2r_we_31/clk] [get_bd_pins uram_2w_2r_we_32/clk] \
  [get_bd_pins uram_2w_2r_we_33/clk] [get_bd_pins uram_2w_2r_we_34/clk] [get_bd_pins uram_2w_2r_we_35/clk] \
  [get_bd_pins uram_2w_2r_we_36/clk] [get_bd_pins uram_2w_2r_we_37/clk] [get_bd_pins uram_2w_2r_we_38/clk] \
  [get_bd_pins uram_2w_2r_we_39/clk] [get_bd_pins uram_2w_2r_we_40/clk] [get_bd_pins uram_2w_2r_we_41/clk] \
  [get_bd_pins uram_2w_2r_we_42/clk] [get_bd_pins uram_2w_2r_we_43/clk] [get_bd_pins uram_2w_2r_we_44/clk] \
  [get_bd_pins uram_2w_2r_we_45/clk] [get_bd_pins uram_2w_2r_we_46/clk] [get_bd_pins uram_2w_2r_we_47/clk] \
  [get_bd_pins uram_2w_2r_we_48/clk] [get_bd_pins uram_2w_2r_we_49/clk] [get_bd_pins uram_2w_2r_we_50/clk] \
  [get_bd_pins uram_2w_2r_we_51/clk] [get_bd_pins uram_2w_2r_we_52/clk] [get_bd_pins uram_2w_2r_we_53/clk] \
  [get_bd_pins uram_2w_2r_we_54/clk] [get_bd_pins uram_2w_2r_we_55/clk] [get_bd_pins uram_2w_2r_we_56/clk] \
  [get_bd_pins uram_2w_2r_we_57/clk] [get_bd_pins uram_2w_2r_we_58/clk] [get_bd_pins uram_2w_2r_we_59/clk] \
  [get_bd_pins uram_2w_2r_we_60/clk] [get_bd_pins uram_2w_2r_we_61/clk] [get_bd_pins uram_2w_2r_we_62/clk] \
  [get_bd_pins uram_2w_2r_we_63/clk]
connect_bd_net -net rst_n_0_1 [get_bd_ports rst_n_0] \
  [get_bd_pins uram_2w_2r_we_0/rst_n] [get_bd_pins uram_2w_2r_we_1/rst_n] [get_bd_pins uram_2w_2r_we_2/rst_n] \
  [get_bd_pins uram_2w_2r_we_3/rst_n] [get_bd_pins uram_2w_2r_we_4/rst_n] [get_bd_pins uram_2w_2r_we_5/rst_n] \
  [get_bd_pins uram_2w_2r_we_6/rst_n] [get_bd_pins uram_2w_2r_we_7/rst_n] [get_bd_pins uram_2w_2r_we_8/rst_n] \
  [get_bd_pins uram_2w_2r_we_9/rst_n] [get_bd_pins uram_2w_2r_we_10/rst_n] [get_bd_pins uram_2w_2r_we_11/rst_n] \
  [get_bd_pins uram_2w_2r_we_12/rst_n] [get_bd_pins uram_2w_2r_we_13/rst_n] [get_bd_pins uram_2w_2r_we_14/rst_n] \
  [get_bd_pins uram_2w_2r_we_15/rst_n] [get_bd_pins uram_2w_2r_we_16/rst_n] [get_bd_pins uram_2w_2r_we_17/rst_n] \
  [get_bd_pins uram_2w_2r_we_18/rst_n] [get_bd_pins uram_2w_2r_we_19/rst_n] [get_bd_pins uram_2w_2r_we_20/rst_n] \
  [get_bd_pins uram_2w_2r_we_21/rst_n] [get_bd_pins uram_2w_2r_we_22/rst_n] [get_bd_pins uram_2w_2r_we_23/rst_n] \
  [get_bd_pins uram_2w_2r_we_24/rst_n] [get_bd_pins uram_2w_2r_we_25/rst_n] [get_bd_pins uram_2w_2r_we_26/rst_n] \
  [get_bd_pins uram_2w_2r_we_27/rst_n] [get_bd_pins uram_2w_2r_we_28/rst_n] [get_bd_pins uram_2w_2r_we_29/rst_n] \
  [get_bd_pins uram_2w_2r_we_30/rst_n] [get_bd_pins uram_2w_2r_we_31/rst_n] [get_bd_pins uram_2w_2r_we_32/rst_n] \
  [get_bd_pins uram_2w_2r_we_33/rst_n] [get_bd_pins uram_2w_2r_we_34/rst_n] [get_bd_pins uram_2w_2r_we_35/rst_n] \
  [get_bd_pins uram_2w_2r_we_36/rst_n] [get_bd_pins uram_2w_2r_we_37/rst_n] [get_bd_pins uram_2w_2r_we_38/rst_n] \
  [get_bd_pins uram_2w_2r_we_39/rst_n] [get_bd_pins uram_2w_2r_we_40/rst_n] [get_bd_pins uram_2w_2r_we_41/rst_n] \
  [get_bd_pins uram_2w_2r_we_42/rst_n] [get_bd_pins uram_2w_2r_we_43/rst_n] [get_bd_pins uram_2w_2r_we_44/rst_n] \
  [get_bd_pins uram_2w_2r_we_45/rst_n] [get_bd_pins uram_2w_2r_we_46/rst_n] [get_bd_pins uram_2w_2r_we_47/rst_n] \
  [get_bd_pins uram_2w_2r_we_48/rst_n] [get_bd_pins uram_2w_2r_we_49/rst_n] [get_bd_pins uram_2w_2r_we_50/rst_n] \
  [get_bd_pins uram_2w_2r_we_51/rst_n] [get_bd_pins uram_2w_2r_we_52/rst_n] [get_bd_pins uram_2w_2r_we_53/rst_n] \
  [get_bd_pins uram_2w_2r_we_54/rst_n] [get_bd_pins uram_2w_2r_we_55/rst_n] [get_bd_pins uram_2w_2r_we_56/rst_n] \
  [get_bd_pins uram_2w_2r_we_57/rst_n] [get_bd_pins uram_2w_2r_we_58/rst_n] [get_bd_pins uram_2w_2r_we_59/rst_n] \
  [get_bd_pins uram_2w_2r_we_60/rst_n] [get_bd_pins uram_2w_2r_we_61/rst_n] [get_bd_pins uram_2w_2r_we_62/rst_n] \
  [get_bd_pins uram_2w_2r_we_63/rst_n]
connect_bd_net -net addr0_0_1 [get_bd_ports addr0_0] [get_bd_pins uram_2w_2r_we_0/addr0]
connect_bd_net -net addr1_0_1 [get_bd_ports addr1_0] [get_bd_pins uram_2w_2r_we_0/addr1]
connect_bd_net -net ce0_0_1 [get_bd_ports ce0_0] [get_bd_pins uram_2w_2r_we_0/ce0]
connect_bd_net -net ce1_0_1 [get_bd_ports ce1_0] [get_bd_pins uram_2w_2r_we_0/ce1]
connect_bd_net [get_bd_pins uram_2w_2r_we_0/rdata0] [get_bd_ports rdata0_0]
connect_bd_net [get_bd_pins uram_2w_2r_we_0/rdata1] [get_bd_ports rdata1_0]
connect_bd_net -net wdata0_0_1 [get_bd_ports wdata0_0] [get_bd_pins uram_2w_2r_we_0/wdata0]
connect_bd_net -net wdata1_0_1 [get_bd_ports wdata1_0] [get_bd_pins uram_2w_2r_we_0/wdata1]
connect_bd_net -net we0_0_1 [get_bd_ports we0_0] [get_bd_pins uram_2w_2r_we_0/we0]
connect_bd_net -net we1_0_1 [get_bd_ports we1_0] [get_bd_pins uram_2w_2r_we_0/we1]
connect_bd_net -net addr0_1_1 [get_bd_ports addr0_1] [get_bd_pins uram_2w_2r_we_1/addr0]
connect_bd_net -net addr1_1_1 [get_bd_ports addr1_1] [get_bd_pins uram_2w_2r_we_1/addr1]
connect_bd_net -net ce0_1_1 [get_bd_ports ce0_1] [get_bd_pins uram_2w_2r_we_1/ce0]
connect_bd_net -net ce1_1_1 [get_bd_ports ce1_1] [get_bd_pins uram_2w_2r_we_1/ce1]
connect_bd_net [get_bd_pins uram_2w_2r_we_1/rdata0] [get_bd_ports rdata0_1]
connect_bd_net [get_bd_pins uram_2w_2r_we_1/rdata1] [get_bd_ports rdata1_1]
connect_bd_net -net wdata0_1_1 [get_bd_ports wdata0_1] [get_bd_pins uram_2w_2r_we_1/wdata0]
connect_bd_net -net wdata1_1_1 [get_bd_ports wdata1_1] [get_bd_pins uram_2w_2r_we_1/wdata1]
connect_bd_net -net we0_1_1 [get_bd_ports we0_1] [get_bd_pins uram_2w_2r_we_1/we0]
connect_bd_net -net we1_1_1 [get_bd_ports we1_1] [get_bd_pins uram_2w_2r_we_1/we1]
connect_bd_net -net addr0_2_1 [get_bd_ports addr0_2] [get_bd_pins uram_2w_2r_we_2/addr0]
connect_bd_net -net addr1_2_1 [get_bd_ports addr1_2] [get_bd_pins uram_2w_2r_we_2/addr1]
connect_bd_net -net ce0_2_1 [get_bd_ports ce0_2] [get_bd_pins uram_2w_2r_we_2/ce0]
connect_bd_net -net ce1_2_1 [get_bd_ports ce1_2] [get_bd_pins uram_2w_2r_we_2/ce1]
connect_bd_net [get_bd_pins uram_2w_2r_we_2/rdata0] [get_bd_ports rdata0_2]
connect_bd_net [get_bd_pins uram_2w_2r_we_2/rdata1] [get_bd_ports rdata1_2]
connect_bd_net -net wdata0_2_1 [get_bd_ports wdata0_2] [get_bd_pins uram_2w_2r_we_2/wdata0]
connect_bd_net -net wdata1_2_1 [get_bd_ports wdata1_2] [get_bd_pins uram_2w_2r_we_2/wdata1]
connect_bd_net -net we0_2_1 [get_bd_ports we0_2] [get_bd_pins uram_2w_2r_we_2/we0]
connect_bd_net -net we1_2_1 [get_bd_ports we1_2] [get_bd_pins uram_2w_2r_we_2/we1]
connect_bd_net -net addr0_3_1 [get_bd_ports addr0_3] [get_bd_pins uram_2w_2r_we_3/addr0]
connect_bd_net -net addr1_3_1 [get_bd_ports addr1_3] [get_bd_pins uram_2w_2r_we_3/addr1]
connect_bd_net -net ce0_3_1 [get_bd_ports ce0_3] [get_bd_pins uram_2w_2r_we_3/ce0]
connect_bd_net -net ce1_3_1 [get_bd_ports ce1_3] [get_bd_pins uram_2w_2r_we_3/ce1]
connect_bd_net [get_bd_pins uram_2w_2r_we_3/rdata0] [get_bd_ports rdata0_3]
connect_bd_net [get_bd_pins uram_2w_2r_we_3/rdata1] [get_bd_ports rdata1_3]
connect_bd_net -net wdata0_3_1 [get_bd_ports wdata0_3] [get_bd_pins uram_2w_2r_we_3/wdata0]
connect_bd_net -net wdata1_3_1 [get_bd_ports wdata1_3] [get_bd_pins uram_2w_2r_we_3/wdata1]
connect_bd_net -net we0_3_1 [get_bd_ports we0_3] [get_bd_pins uram_2w_2r_we_3/we0]
connect_bd_net -net we1_3_1 [get_bd_ports we1_3] [get_bd_pins uram_2w_2r_we_3/we1]
connect_bd_net -net addr0_4_1 [get_bd_ports addr0_4] [get_bd_pins uram_2w_2r_we_4/addr0]
connect_bd_net -net addr1_4_1 [get_bd_ports addr1_4] [get_bd_pins uram_2w_2r_we_4/addr1]
connect_bd_net -net ce0_4_1 [get_bd_ports ce0_4] [get_bd_pins uram_2w_2r_we_4/ce0]
connect_bd_net -net ce1_4_1 [get_bd_ports ce1_4] [get_bd_pins uram_2w_2r_we_4/ce1]
connect_bd_net [get_bd_pins uram_2w_2r_we_4/rdata0] [get_bd_ports rdata0_4]
connect_bd_net [get_bd_pins uram_2w_2r_we_4/rdata1] [get_bd_ports rdata1_4]
connect_bd_net -net wdata0_4_1 [get_bd_ports wdata0_4] [get_bd_pins uram_2w_2r_we_4/wdata0]
connect_bd_net -net wdata1_4_1 [get_bd_ports wdata1_4] [get_bd_pins uram_2w_2r_we_4/wdata1]
connect_bd_net -net we0_4_1 [get_bd_ports we0_4] [get_bd_pins uram_2w_2r_we_4/we0]
connect_bd_net -net we1_4_1 [get_bd_ports we1_4] [get_bd_pins uram_2w_2r_we_4/we1]
connect_bd_net -net addr0_5_1 [get_bd_ports addr0_5] [get_bd_pins uram_2w_2r_we_5/addr0]
connect_bd_net -net addr1_5_1 [get_bd_ports addr1_5] [get_bd_pins uram_2w_2r_we_5/addr1]
connect_bd_net -net ce0_5_1 [get_bd_ports ce0_5] [get_bd_pins uram_2w_2r_we_5/ce0]
connect_bd_net -net ce1_5_1 [get_bd_ports ce1_5] [get_bd_pins uram_2w_2r_we_5/ce1]
connect_bd_net [get_bd_pins uram_2w_2r_we_5/rdata0] [get_bd_ports rdata0_5]
connect_bd_net [get_bd_pins uram_2w_2r_we_5/rdata1] [get_bd_ports rdata1_5]
connect_bd_net -net wdata0_5_1 [get_bd_ports wdata0_5] [get_bd_pins uram_2w_2r_we_5/wdata0]
connect_bd_net -net wdata1_5_1 [get_bd_ports wdata1_5] [get_bd_pins uram_2w_2r_we_5/wdata1]
connect_bd_net -net we0_5_1 [get_bd_ports we0_5] [get_bd_pins uram_2w_2r_we_5/we0]
connect_bd_net -net we1_5_1 [get_bd_ports we1_5] [get_bd_pins uram_2w_2r_we_5/we1]
connect_bd_net -net addr0_6_1 [get_bd_ports addr0_6] [get_bd_pins uram_2w_2r_we_6/addr0]
connect_bd_net -net addr1_6_1 [get_bd_ports addr1_6] [get_bd_pins uram_2w_2r_we_6/addr1]
connect_bd_net -net ce0_6_1 [get_bd_ports ce0_6] [get_bd_pins uram_2w_2r_we_6/ce0]
connect_bd_net -net ce1_6_1 [get_bd_ports ce1_6] [get_bd_pins uram_2w_2r_we_6/ce1]
connect_bd_net [get_bd_pins uram_2w_2r_we_6/rdata0] [get_bd_ports rdata0_6]
connect_bd_net [get_bd_pins uram_2w_2r_we_6/rdata1] [get_bd_ports rdata1_6]
connect_bd_net -net wdata0_6_1 [get_bd_ports wdata0_6] [get_bd_pins uram_2w_2r_we_6/wdata0]
connect_bd_net -net wdata1_6_1 [get_bd_ports wdata1_6] [get_bd_pins uram_2w_2r_we_6/wdata1]
connect_bd_net -net we0_6_1 [get_bd_ports we0_6] [get_bd_pins uram_2w_2r_we_6/we0]
connect_bd_net -net we1_6_1 [get_bd_ports we1_6] [get_bd_pins uram_2w_2r_we_6/we1]
connect_bd_net -net addr0_7_1 [get_bd_ports addr0_7] [get_bd_pins uram_2w_2r_we_7/addr0]
connect_bd_net -net addr1_7_1 [get_bd_ports addr1_7] [get_bd_pins uram_2w_2r_we_7/addr1]
connect_bd_net -net ce0_7_1 [get_bd_ports ce0_7] [get_bd_pins uram_2w_2r_we_7/ce0]
connect_bd_net -net ce1_7_1 [get_bd_ports ce1_7] [get_bd_pins uram_2w_2r_we_7/ce1]
connect_bd_net [get_bd_pins uram_2w_2r_we_7/rdata0] [get_bd_ports rdata0_7]
connect_bd_net [get_bd_pins uram_2w_2r_we_7/rdata1] [get_bd_ports rdata1_7]
connect_bd_net -net wdata0_7_1 [get_bd_ports wdata0_7] [get_bd_pins uram_2w_2r_we_7/wdata0]
connect_bd_net -net wdata1_7_1 [get_bd_ports wdata1_7] [get_bd_pins uram_2w_2r_we_7/wdata1]
connect_bd_net -net we0_7_1 [get_bd_ports we0_7] [get_bd_pins uram_2w_2r_we_7/we0]
connect_bd_net -net we1_7_1 [get_bd_ports we1_7] [get_bd_pins uram_2w_2r_we_7/we1]
connect_bd_net -net addr0_8_1 [get_bd_ports addr0_8] [get_bd_pins uram_2w_2r_we_8/addr0]
connect_bd_net -net addr1_8_1 [get_bd_ports addr1_8] [get_bd_pins uram_2w_2r_we_8/addr1]
connect_bd_net -net ce0_8_1 [get_bd_ports ce0_8] [get_bd_pins uram_2w_2r_we_8/ce0]
connect_bd_net -net ce1_8_1 [get_bd_ports ce1_8] [get_bd_pins uram_2w_2r_we_8/ce1]
connect_bd_net [get_bd_pins uram_2w_2r_we_8/rdata0] [get_bd_ports rdata0_8]
connect_bd_net [get_bd_pins uram_2w_2r_we_8/rdata1] [get_bd_ports rdata1_8]
connect_bd_net -net wdata0_8_1 [get_bd_ports wdata0_8] [get_bd_pins uram_2w_2r_we_8/wdata0]
connect_bd_net -net wdata1_8_1 [get_bd_ports wdata1_8] [get_bd_pins uram_2w_2r_we_8/wdata1]
connect_bd_net -net we0_8_1 [get_bd_ports we0_8] [get_bd_pins uram_2w_2r_we_8/we0]
connect_bd_net -net we1_8_1 [get_bd_ports we1_8] [get_bd_pins uram_2w_2r_we_8/we1]
connect_bd_net -net addr0_9_1 [get_bd_ports addr0_9] [get_bd_pins uram_2w_2r_we_9/addr0]
connect_bd_net -net addr1_9_1 [get_bd_ports addr1_9] [get_bd_pins uram_2w_2r_we_9/addr1]
connect_bd_net -net ce0_9_1 [get_bd_ports ce0_9] [get_bd_pins uram_2w_2r_we_9/ce0]
connect_bd_net -net ce1_9_1 [get_bd_ports ce1_9] [get_bd_pins uram_2w_2r_we_9/ce1]
connect_bd_net [get_bd_pins uram_2w_2r_we_9/rdata0] [get_bd_ports rdata0_9]
connect_bd_net [get_bd_pins uram_2w_2r_we_9/rdata1] [get_bd_ports rdata1_9]
connect_bd_net -net wdata0_9_1 [get_bd_ports wdata0_9] [get_bd_pins uram_2w_2r_we_9/wdata0]
connect_bd_net -net wdata1_9_1 [get_bd_ports wdata1_9] [get_bd_pins uram_2w_2r_we_9/wdata1]
connect_bd_net -net we0_9_1 [get_bd_ports we0_9] [get_bd_pins uram_2w_2r_we_9/we0]
connect_bd_net -net we1_9_1 [get_bd_ports we1_9] [get_bd_pins uram_2w_2r_we_9/we1]
connect_bd_net -net addr0_10_1 [get_bd_ports addr0_10] [get_bd_pins uram_2w_2r_we_10/addr0]
connect_bd_net -net addr1_10_1 [get_bd_ports addr1_10] [get_bd_pins uram_2w_2r_we_10/addr1]
connect_bd_net -net ce0_10_1 [get_bd_ports ce0_10] [get_bd_pins uram_2w_2r_we_10/ce0]
connect_bd_net -net ce1_10_1 [get_bd_ports ce1_10] [get_bd_pins uram_2w_2r_we_10/ce1]
connect_bd_net [get_bd_pins uram_2w_2r_we_10/rdata0] [get_bd_ports rdata0_10]
connect_bd_net [get_bd_pins uram_2w_2r_we_10/rdata1] [get_bd_ports rdata1_10]
connect_bd_net -net wdata0_10_1 [get_bd_ports wdata0_10] [get_bd_pins uram_2w_2r_we_10/wdata0]
connect_bd_net -net wdata1_10_1 [get_bd_ports wdata1_10] [get_bd_pins uram_2w_2r_we_10/wdata1]
connect_bd_net -net we0_10_1 [get_bd_ports we0_10] [get_bd_pins uram_2w_2r_we_10/we0]
connect_bd_net -net we1_10_1 [get_bd_ports we1_10] [get_bd_pins uram_2w_2r_we_10/we1]
connect_bd_net -net addr0_11_1 [get_bd_ports addr0_11] [get_bd_pins uram_2w_2r_we_11/addr0]
connect_bd_net -net addr1_11_1 [get_bd_ports addr1_11] [get_bd_pins uram_2w_2r_we_11/addr1]
connect_bd_net -net ce0_11_1 [get_bd_ports ce0_11] [get_bd_pins uram_2w_2r_we_11/ce0]
connect_bd_net -net ce1_11_1 [get_bd_ports ce1_11] [get_bd_pins uram_2w_2r_we_11/ce1]
connect_bd_net [get_bd_pins uram_2w_2r_we_11/rdata0] [get_bd_ports rdata0_11]
connect_bd_net [get_bd_pins uram_2w_2r_we_11/rdata1] [get_bd_ports rdata1_11]
connect_bd_net -net wdata0_11_1 [get_bd_ports wdata0_11] [get_bd_pins uram_2w_2r_we_11/wdata0]
connect_bd_net -net wdata1_11_1 [get_bd_ports wdata1_11] [get_bd_pins uram_2w_2r_we_11/wdata1]
connect_bd_net -net we0_11_1 [get_bd_ports we0_11] [get_bd_pins uram_2w_2r_we_11/we0]
connect_bd_net -net we1_11_1 [get_bd_ports we1_11] [get_bd_pins uram_2w_2r_we_11/we1]
connect_bd_net -net addr0_12_1 [get_bd_ports addr0_12] [get_bd_pins uram_2w_2r_we_12/addr0]
connect_bd_net -net addr1_12_1 [get_bd_ports addr1_12] [get_bd_pins uram_2w_2r_we_12/addr1]
connect_bd_net -net ce0_12_1 [get_bd_ports ce0_12] [get_bd_pins uram_2w_2r_we_12/ce0]
connect_bd_net -net ce1_12_1 [get_bd_ports ce1_12] [get_bd_pins uram_2w_2r_we_12/ce1]
connect_bd_net [get_bd_pins uram_2w_2r_we_12/rdata0] [get_bd_ports rdata0_12]
connect_bd_net [get_bd_pins uram_2w_2r_we_12/rdata1] [get_bd_ports rdata1_12]
connect_bd_net -net wdata0_12_1 [get_bd_ports wdata0_12] [get_bd_pins uram_2w_2r_we_12/wdata0]
connect_bd_net -net wdata1_12_1 [get_bd_ports wdata1_12] [get_bd_pins uram_2w_2r_we_12/wdata1]
connect_bd_net -net we0_12_1 [get_bd_ports we0_12] [get_bd_pins uram_2w_2r_we_12/we0]
connect_bd_net -net we1_12_1 [get_bd_ports we1_12] [get_bd_pins uram_2w_2r_we_12/we1]
connect_bd_net -net addr0_13_1 [get_bd_ports addr0_13] [get_bd_pins uram_2w_2r_we_13/addr0]
connect_bd_net -net addr1_13_1 [get_bd_ports addr1_13] [get_bd_pins uram_2w_2r_we_13/addr1]
connect_bd_net -net ce0_13_1 [get_bd_ports ce0_13] [get_bd_pins uram_2w_2r_we_13/ce0]
connect_bd_net -net ce1_13_1 [get_bd_ports ce1_13] [get_bd_pins uram_2w_2r_we_13/ce1]
connect_bd_net [get_bd_pins uram_2w_2r_we_13/rdata0] [get_bd_ports rdata0_13]
connect_bd_net [get_bd_pins uram_2w_2r_we_13/rdata1] [get_bd_ports rdata1_13]
connect_bd_net -net wdata0_13_1 [get_bd_ports wdata0_13] [get_bd_pins uram_2w_2r_we_13/wdata0]
connect_bd_net -net wdata1_13_1 [get_bd_ports wdata1_13] [get_bd_pins uram_2w_2r_we_13/wdata1]
connect_bd_net -net we0_13_1 [get_bd_ports we0_13] [get_bd_pins uram_2w_2r_we_13/we0]
connect_bd_net -net we1_13_1 [get_bd_ports we1_13] [get_bd_pins uram_2w_2r_we_13/we1]
connect_bd_net -net addr0_14_1 [get_bd_ports addr0_14] [get_bd_pins uram_2w_2r_we_14/addr0]
connect_bd_net -net addr1_14_1 [get_bd_ports addr1_14] [get_bd_pins uram_2w_2r_we_14/addr1]
connect_bd_net -net ce0_14_1 [get_bd_ports ce0_14] [get_bd_pins uram_2w_2r_we_14/ce0]
connect_bd_net -net ce1_14_1 [get_bd_ports ce1_14] [get_bd_pins uram_2w_2r_we_14/ce1]
